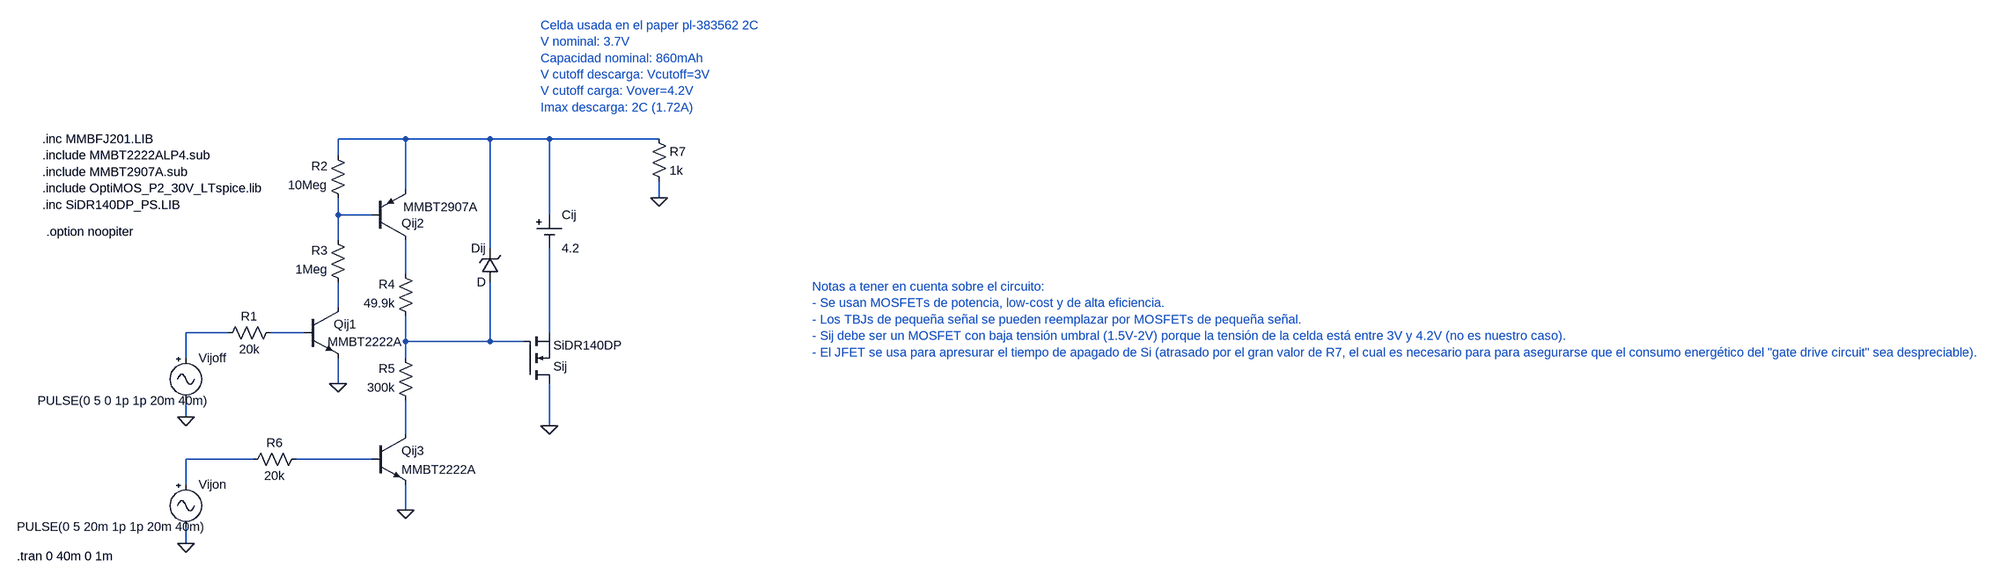
[diagram p0: schematic mitad_del_switch.asc]
mitad_del_switch.asc, the LTspice schematic file:
Version 4.1
SHEET 1 3348 740
WIRE 16 -576 -112 -576
WIRE 176 -576 16 -576
WIRE 288 -576 176 -576
WIRE 496 -576 288 -576
WIRE -112 -544 -112 -576
WIRE 16 -480 16 -576
WIRE 496 -464 496 -496
WIRE -112 -432 -112 -464
WIRE -48 -432 -112 -432
WIRE 288 -432 288 -576
WIRE -112 -384 -112 -432
WIRE 176 -368 176 -576
WIRE 16 -320 16 -384
WIRE -112 -256 -112 -304
WIRE -320 -208 -400 -208
WIRE -176 -208 -240 -208
WIRE 288 -208 288 -368
WIRE 16 -192 16 -240
WIRE 176 -192 176 -304
WIRE 176 -192 16 -192
WIRE 240 -192 176 -192
WIRE -400 -160 -400 -208
WIRE 16 -160 16 -192
WIRE -112 -112 -112 -160
WIRE -400 -48 -400 -80
WIRE 288 -32 288 -112
WIRE 16 -16 16 -80
WIRE -272 32 -400 32
WIRE -48 32 -192 32
WIRE -400 80 -400 32
WIRE 16 128 16 80
WIRE -400 192 -400 160
FLAG -400 192 0
FLAG -400 -48 0
FLAG -112 -112 0
FLAG 16 128 0
FLAG 288 -32 0
FLAG 496 -464 0
SYMBOL Misc\\cell 288 -432 R0
WINDOW 123 0 0 Left 0
WINDOW 39 0 0 Left 0
SYMATTR InstName Cij
SYMATTR Value 4.2
SYMBOL Misc\\signal -400 -176 R0
WINDOW 3 -281 97 Left 2
WINDOW 123 0 0 Left 0
WINDOW 39 0 0 Left 0
SYMATTR Value PULSE(0 5 0 1p 1p 20m 40m)
SYMATTR InstName Vijoff
SYMBOL Misc\\signal -400 64 R0
WINDOW 3 -320 96 Left 2
WINDOW 123 0 0 Left 0
WINDOW 39 0 0 Left 0
SYMATTR Value PULSE(0 5 20m 1p 1p 20m 40m)
SYMATTR InstName Vijon
SYMBOL npn -176 -256 R0
WINDOW 3 44 65 Left 2
SYMATTR Value MMBT2222A
SYMATTR InstName Qij1
SYMBOL nmos 240 -112 M180
SYMATTR InstName Sij
SYMATTR Value SiDR140DP
SYMATTR Prefix X
SYMBOL pnp -48 -384 M180
WINDOW 3 60 63 Left 2
SYMATTR Value MMBT2907A
SYMATTR InstName Qij2
SYMBOL npn -48 -16 R0
SYMATTR InstName Qij3
SYMATTR Value MMBT2222A
SYMBOL zener 192 -304 R180
WINDOW 0 24 64 Left 2
WINDOW 3 24 0 Left 2
SYMATTR InstName Dij
SYMBOL res -224 -224 R90
WINDOW 0 0 56 VBottom 2
WINDOW 3 32 56 VTop 2
SYMATTR InstName R1
SYMATTR Value 20k
SYMBOL res -96 -448 R180
WINDOW 0 36 76 Left 2
WINDOW 3 36 40 Left 2
SYMATTR InstName R2
SYMATTR Value 10Meg
SYMBOL res -96 -288 R180
WINDOW 0 36 76 Left 2
WINDOW 3 36 40 Left 2
SYMATTR InstName R3
SYMATTR Value 1Meg
SYMBOL res 32 -224 R180
WINDOW 0 36 76 Left 2
WINDOW 3 36 40 Left 2
SYMATTR InstName R4
SYMATTR Value 49.9k
SYMBOL res 32 -64 R180
WINDOW 0 36 76 Left 2
WINDOW 3 36 40 Left 2
SYMATTR InstName R5
SYMATTR Value 300k
SYMBOL res -288 48 R270
WINDOW 0 32 56 VTop 2
WINDOW 3 0 56 VBottom 2
SYMATTR InstName R6
SYMATTR Value 20k
SYMBOL res 480 -592 R0
SYMATTR InstName R7
SYMATTR Value 1k
TEXT 976 -296 Left 2 ;Notas a tener en cuenta sobre el circuito:\n- Se usan MOSFETs de potencia, low-cost y de alta eficiencia.\n- Los TBJs de pequeña señal se pueden reemplazar por MOSFETs de pequeña señal.\n- Sij debe ser un MOSFET con baja tensión umbral (1.5V-2V) porque la tensión de la celda está entre 3V y 4.2V (no es nuestro caso).\n- El JFET se usa para apresurar el tiempo de apagado de Si (atrasado por el gran valor de R7, el cual es necesario para para asegurarse que el consumo energético del "gate drive circuit" sea despreciable).
TEXT 272 -792 Left 2 ;Celda usada en el paper pl-383562 2C\nV nominal: 3.7V\nCapacidad nominal: 860mAh\nV cutoff descarga: Vcutoff=3V\nV cutoff carga: Vover=4.2V\nImax descarga: 2C (1.72A)
TEXT -672 -576 Left 2 !.inc MMBFJ201.LIB\n.include MMBT2222ALP4.sub\n.include MMBT2907A.sub\n.include OptiMOS_P2_30V_LTspice.lib\n.inc SiDR140DP_PS.LIB
TEXT -720 216 Left 2 !.tran 0 40m 0 1m
TEXT -664 -400 Left 2 !.option noopiter

The netlist it stands for:
* mitad_del_switch.asc
V§Cij N001 N007 4.2
Vijoff N005 0 PULSE(0 5 0 1p 1p 20m 40m)
Vijon N010 0 PULSE(0 5 20m 1p 1p 20m 40m)
Qij1 N004 N006 0 0 MMBT2222A
X§Sij 0 N008 N007 SiDR140DP  ; pins D G S
Qij2 N003 N002 N001 0 MMBT2907A
Qij3 N009 N011 0 0 MMBT2222A
Dij N008 N001 D
R1 N006 N005 20k
R2 N002 N001 10Meg
R3 N004 N002 1Meg
R4 N008 N003 49.9k
R5 N009 N008 300k
R6 N010 N011 20k
R7 N001 0 1k
.model D D
.lib standard.dio
.model NPN NPN
.model PNP PNP
.lib standard.bjt
* Notas a tener en cuenta sobre el circuito:
* - Se usan MOSFETs de potencia, low-cost y de alta eficiencia.
* - Los TBJs de pequeña señal se pueden reemplazar por MOSFETs de pequeña señal.
* - Sij debe ser un MOSFET con baja tensión umbral (1.5V-2V) porque la tensión de la celda está entre 3V y 4.2V (no es nuestro caso).
* - El JFET se usa para apresurar el tiempo de apagado de Si (atrasado por el gran valor de R7, el cual es necesario para para asegurarse que el consumo energético del "gate drive circuit" sea despreciable).
* Celda usada en el paper pl-383562 2C
* V nominal: 3.7V
* Capacidad nominal: 860mAh
* V cutoff descarga: Vcutoff=3V
* V cutoff carga: Vover=4.2V
* Imax descarga: 2C (1.72A)
.inc MMBFJ201.LIB
.include MMBT2222ALP4.sub
.include MMBT2907A.sub
.include OptiMOS_P2_30V_LTspice.lib
.inc SiDR140DP_PS.LIB
.tran 0 40m 0 1m
.option noopiter
.backanno
.end